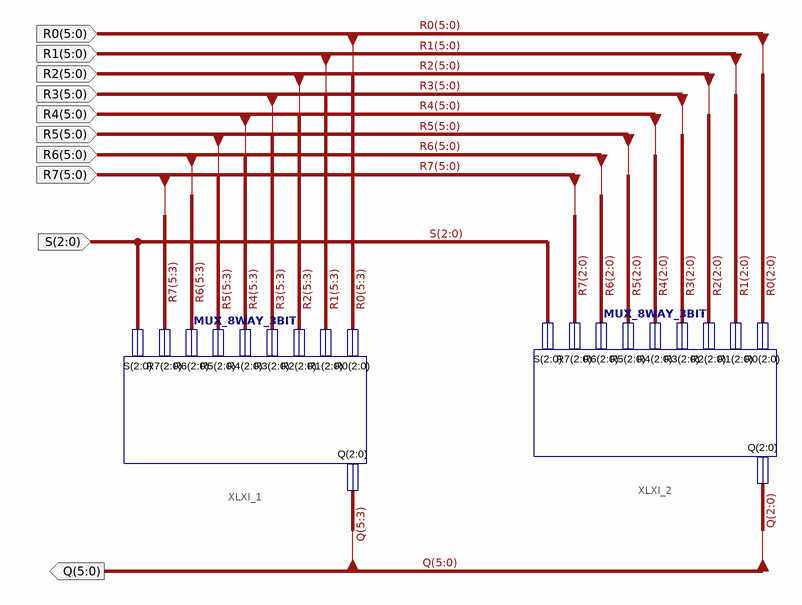
[diagram p0: schematic sheet 1]
// Xilinx ISE schematic MUX_8WAY_6BIT.sch (spartan3e) as structural Verilog: 2 symbols, 10 ports
module MUX_8WAY_6BIT (
  input  [5:0] R0,
  input  [5:0] R1,
  input  [5:0] R2,
  input  [5:0] R3,
  input  [5:0] R4,
  input  [5:0] R5,
  input  [5:0] R6,
  input  [5:0] R7,
  input  [2:0] S,
  output [5:0] Q
);

  MUX_8WAY_3BIT XLXI_1 (
    .Q(Q[5:3]), .R0(R0[5:3]), .R1(R1[5:3]), .R2(R2[5:3]), .R3(R3[5:3]), .R4(R4[5:3]), .R5(R5[5:3]),
    .R6(R6[5:3]), .R7(R7[5:3]), .S(S));
  MUX_8WAY_3BIT XLXI_2 (
    .Q(Q[2:0]), .R0(R0[2:0]), .R1(R1[2:0]), .R2(R2[2:0]), .R3(R3[2:0]), .R4(R4[2:0]), .R5(R5[2:0]),
    .R6(R6[2:0]), .R7(R7[2:0]), .S(S));
endmodule
